# EAGLE design ATtiny85 Programmer (EAGLE 9.6.2)
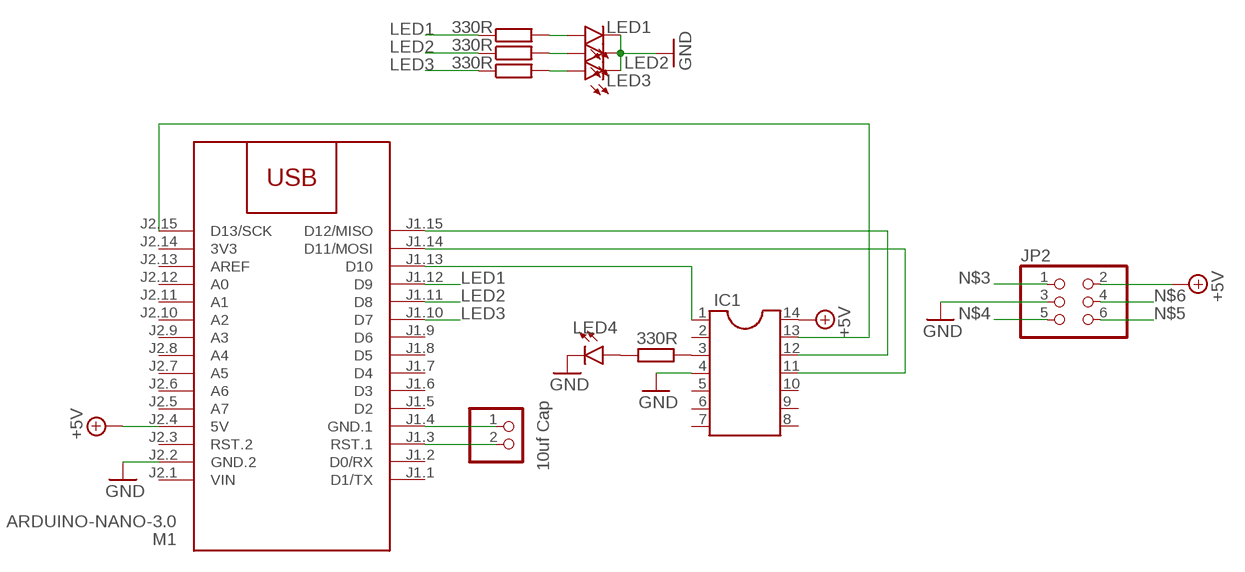
[diagram p0: schematic, sheet 1]

## Parts
IC1  DIL14  [DIL14]
JP1  10uf Cap  PINHD-1X2  [1X02]
JP2  PINHD-2X3  [2X03]
LED1  LED3MM  [LED3MM]
LED2  LED3MM  [LED3MM]
LED3  LED3MM  [LED3MM]
LED4  LED3MM  [LED3MM]
M1  ARDUINO-NANO-3.0  [ARDUINO-NANO-3.0]
R1  330R  R-EU_0207/10  [0207/10]
R2  330R  R-EU_0207/10  [0207/10]
R3  330R  R-EU_0207/10  [0207/10]
R4  330R  R-EU_0207/10  [0207/10]

## Nets
+5V: IC1.14 JP2.2 M1.J2.4(5V)
GND: IC1.4 JP2.3 LED1.K(C) LED2.K(C) LED3.K(C) LED4.K(C) M1.J2.2(GND.2)
LED1: M1.J1.12(D9) R4.1
LED2: M1.J1.11(D8) R1.1
LED3: M1.J1.10(D7) R2.1
N$1: JP1.2 M1.J1.3(RST.1)
N$2: JP1.1 M1.J1.4(GND.1)
N$3: IC1.1 JP2.1 M1.J1.13(D10)
N$4: IC1.11 JP2.5 M1.J1.14(D11/MOSI)
N$5: IC1.12 JP2.6 M1.J1.15(D12/MISO)
N$6: IC1.13 JP2.4 M1.J2.15(D13/SCK)
N$7: IC1.3 R3.2
N$8: LED1.A R4.2
N$9: LED2.A R1.2
N$10: LED3.A R2.2
N$13: LED4.A R3.1
Unconnected: IC1.2 IC1.5 IC1.6 IC1.7 IC1.8 IC1.9 IC1.10 M1.J1.1(D1/TX) M1.J1.2(D0/RX) M1.J1.5(D2) M1.J1.6(D3) M1.J1.7(D4) M1.J1.8(D5) M1.J1.9(D6) M1.J2.3(RST.2) M1.J2.5(A7) M1.J2.6(A6) M1.J2.7(A5) M1.J2.8(A4) M1.J2.9(A3) M1.J2.10(A2) M1.J2.11(A1) M1.J2.12(A0) M1.J2.13(AREF)

## Power pins joined to a net without a drawn wire
3V3: M1.J2.14(3V3)
VIN: M1.J2.1(VIN)

## Library data of the parts
IC1 = ic-package:DIL14: Dual In Line / Socket
JP1 = pinhead:PINHD-1X2: PIN HEADER
JP2 = pinhead:PINHD-2X3: PIN HEADER
LED1-LED4 = led:LED: LED OSRAM: - CHIPLED LG R971, LG N971, LY N971, LG Q971, LY Q971, LO R971, LY R971 LH N974, LH R974 LS Q976, LO Q976, LY Q976 LO Q996 - Hyper CHIPLED LW Q18S LB Q993, LB Q99A, LB R99A - SideLED LS A670, LO A670, LY A670, LG A670, LP A670 LB A673, LV A673, LT A673, LW A673 LH A674 LY A675 LS A676, LA A676, LO A676, LY A676, LW A676 LS A679, LY A679, LG A679 - Hyper Micro SIDELED® LS Y876, LA Y876, LO Y876, LY Y876 LT Y87S - SmartLED LW L88C, LW L88S LB L89C, LB L89S, LG L890 LS L89K, LO L89K, LY L89K LS L896, LA L896, LO L896, LY L896 - TOPLED LS T670, LO T670, LY T670, LG T670, LP T670 LSG T670, LSP T670, LSY T670, LOP T670, LYG T670 LG T671, LOG T671, LSG T671 LB T673, LV T673, LT T673, LW T673 LH T674 LS T676, LA T676, LO T676, LY T676, LB T676, LH T676, LSB T676, LW T676 LB T67C, LV T67C, LT T67C, LS T67K, LO T67K, LY T67K, LW E67C LS E67B, LA E67B, LO E67B, LY E67B, LB E67C, LV E67C, LT E67C LW T67C LS T679, LY T679, LG T679 LS T770, LO T770, LY T770, LG T770, LP T770 LB T773, LV T773, LT T773, LW T773 LH T774 LS E675, LA E675, LY E675, LS T675 LS T776, LA T776, LO T776, LY T776, LB T776 LHGB T686 LT T68C, LB T68C - Hyper Mini TOPLED® LB M676 - Mini TOPLED Santana® LG M470 LS M47K, LO M47K, LY M47K Source: http://www.osram.convergy.de LUXEON: - LUMILED® LXK2-PW12-R00, LXK2-PW12-S00, LXK2-PW14-U00, LXK2-PW14-V00 LXK2-PM12-R00, LXK2-PM12-S00, LXK2-PM14-U00 LXK2-PE12-Q00, LXK2-PE12-R00, LXK2-PE12-S00, LXK2-PE14-T00, LXK2-PE14-U00 LXK2-PB12-K00, LXK2-PB12-L00, LXK2-PB12-M00, LXK2-PB14-N00, LXK2-PB14-P00, LXK2-PB14-Q00 LXK2-PR12-L00, LXK2-PR12-M00, LXK2-PR14-Q00, LXK2-PR14-R00 LXK2-PD12-Q00, LXK2-PD12-R00, LXK2-PD12-S00 LXK2-PH12-R00, LXK2-PH12-S00 LXK2-PL12-P00, LXK2-PL12-Q00, LXK2-PL12-R00 Source: www.luxeon.com KINGBRIGHT: KA-3528ASYC Source: www.kingbright.com
M1 = diy-modules:ARDUINO-NANO-3.0: Arduino Nano 3.0 and compatible devices More details available here: https://www.arduino.cc/en/Main/ArduinoBoardNano Click here to find device on ebay.com <http://www.ebay.com/sch/arduino+nano>
R1-R4 = rcl:R-EU_: RESISTOR, European symbol; SPICEPREFIX: R

## Board
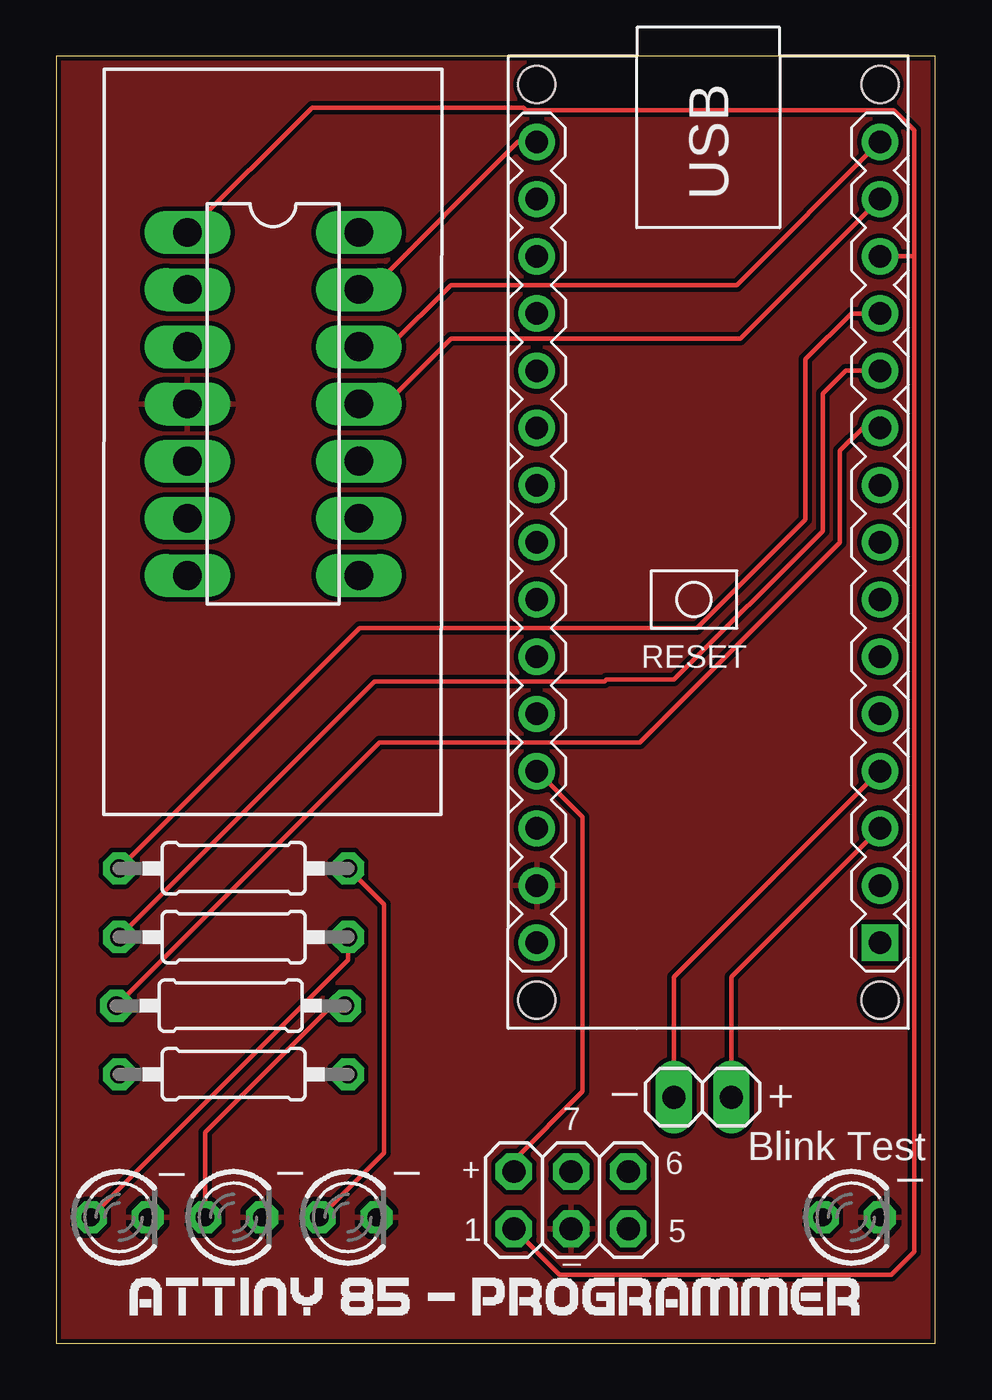
[diagram p1: board, top side]
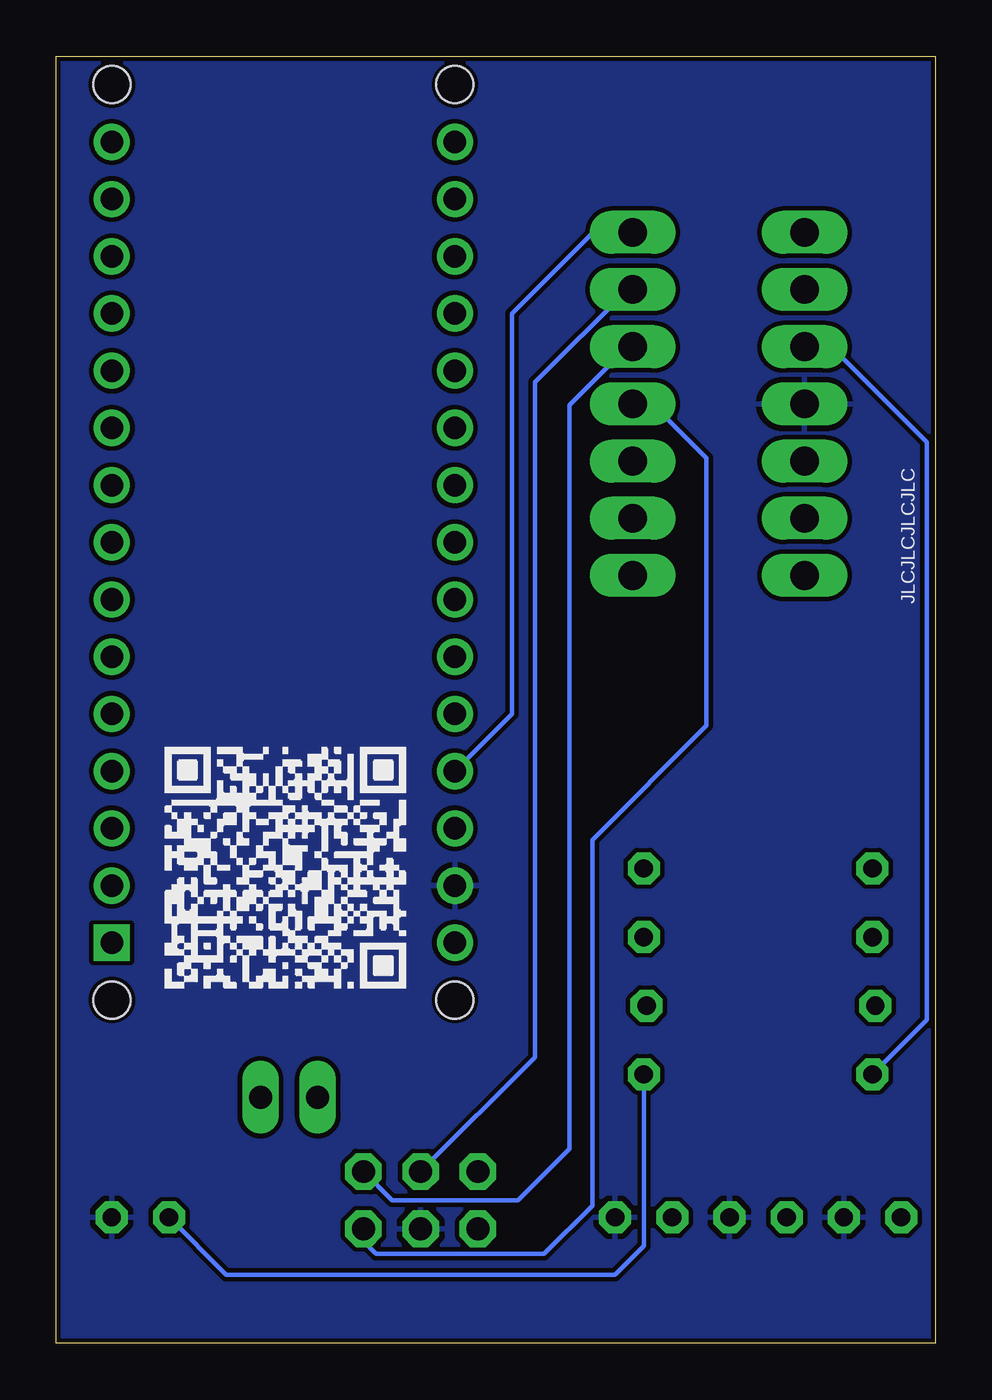
[diagram p2: board, bottom side, seen from below]

Size 39.04 x 57.14 mm. Coordinates in mm from the lower left corner, seen from the top.
Outline: 0,0 39.04,0 39.04,57.14 0,57.14 0,0
Copper layers (1*16): Top 0.035mm / dielectric 1.5mm / Bottom 0.035mm
Design rules "SparkFun": minimum track width 8mil, minimum drill 20mil, track to track 8mil, track to pad 8mil, pad to pad 8mil, via to via 8mil, smd to smd 8mil, copper to edge 8mil, drill to drill 8mil, minimum pad ring 12mil, minimum via ring 10mil, stop-mask expansion 4mil, vias tented up to drill 20mil, thermal gap 10mil

### Footprints (pad centres in the part's own frame; a part is rotated, then mirrored left to right if it is on the bottom)
DIL14 = drill 1.27 pad 1.524 long: 1 -7.62,-3.81; 2 -5.08,-3.81; 3 -2.54,-3.81; 4 0,-3.81; 5 2.54,-3.81; 6 5.08,-3.81; 7 7.62,-3.81; 8 7.62,3.81; 9 5.08,3.81; 10 2.54,3.81; 11 0,3.81; 12 -2.54,3.81; 13 -5.08,3.81; 14 -7.62,3.81
1X02 = drill 1.016 long: 1 -1.27,0; 2 1.27,0
2X03 = drill 1.016 octagon: 1 -2.54,-1.27; 2 -2.54,1.27; 3 0,-1.27; 4 0,1.27; 5 2.54,-1.27; 6 2.54,1.27
LED3MM = drill 0.813 octagon: A -1.27,0; K 1.27,0
ARDUINO-NANO-3.0 = drill 1 square: J1.1 17.78,7.62 | drill 1: J1.2 15.24,7.62; J1.3 12.7,7.62; J1.4 10.16,7.62; J1.5 7.62,7.62; J1.6 5.08,7.62; J1.7 2.54,7.62; J1.8 0,7.62; J1.9 -2.54,7.62; J1.10 -5.08,7.62; J1.11 -7.62,7.62; J1.12 -10.16,7.62; J1.13 -12.7,7.62; J1.14 -15.24,7.62; J1.15 -17.78,7.62; J2.1 17.78,-7.62; J2.2 15.24,-7.62; J2.3 12.7,-7.62; J2.4 10.16,-7.62; J2.5 7.62,-7.62; J2.6 5.08,-7.62; J2.7 2.54,-7.62; J2.8 0,-7.62; J2.9 -2.54,-7.62; J2.10 -5.08,-7.62; J2.11 -7.62,-7.62; J2.12 -10.16,-7.62; J2.13 -12.7,-7.62; J2.14 -15.24,-7.62; J2.15 -17.78,-7.62 | hole 1.651: -20.32,7.62; -20.32,-7.62; 20.32,-7.62; 20.32,7.62
0207/10 = drill 0.813 octagon: 1 -5.08,0; 2 5.08,0

### Placement (x,y rotation side)
IC1  9.63,41.71 270 top
JP1  28.7,10.92 0 top
JP2  22.86,6.35 0 top
LED1  12.95,5.59 0 top
LED2  2.79,5.59 0 top
LED3  7.87,5.59 0 top
LED4  35.31,5.59 0 top
M1  28.96,35.56 270 top
R1  7.87,18.03 0 top
R2  7.75,14.99 0 top
R3  7.87,11.94 180 top
R4  7.87,21.08 0 top

### Tracks (layer width: path | path; a pad name or v marks a point on that pad's centre or on a via)
+5V
  Top 0.203: JP2.2 20.32,8.13 23.37,11.18 23.37,23.37 M1.J2.4
  Bottom 0.203: M1.J2.4 18.8,27.94 18.8,45.72 15.19,49.33 IC1.14
GND
  pour Top: 0,57.15 39.12,57.15 39.12,0 0,0
  pour Bottom: 0,57.15 39.12,57.15 39.12,0 0,0
LED1
  Top 0.203: R4.1 13.46,31.75 28.45,31.75 33.27,36.58 33.27,43.69 35.31,45.72 M1.J1.12
LED2
  Top 0.203: R1.1 14.13,29.37 24.34,29.37 24.43,29.46 27.43,29.46 34.04,36.07 34.04,42.16 35.05,43.18 M1.J1.11
LED3
  Top 0.203: R2.1 14.35,26.67 25.91,26.67 34.8,35.56 34.8,39.62 35.81,40.64 M1.J1.10
N$1
  Top 0.203: JP1.2 29.97,16.26 M1.J1.3
N$2
  Top 0.203: JP1.1 27.43,16.26 M1.J1.4
N$3
  Top 0.203: JP2.1 22.35,3.05 37.08,3.05 38.1,4.06 38.1,48.26 | 38.1,48.26 38.1,53.85 37.2,54.75 20.87,54.75 20.75,54.86 11.35,54.86 IC1.1 | M1.J1.13 38.1,48.26
N$4
  Top 0.203: M1.J1.14 30.39,44.61 17.53,44.61 14.62,41.71 IC1.11
  Bottom 0.203: JP2.5 25.4,4.52 24.85,3.96 17.37,3.96 15.24,6.1 15.24,22.35 10.16,27.43 10.16,39.31 12.56,41.71 IC1.11
N$5
  Top 0.203: M1.J1.15 30.23,46.99 17.53,46.99 14.78,44.25 IC1.12
  Bottom 0.203: JP2.6 24.13,6.35 18.54,6.35 16.26,8.64 16.26,41.66 13.66,44.25 IC1.12
N$6
  Top 0.203: M1.J2.15 20.51,53.34 13.96,46.79 IC1.13
  Bottom 0.203: JP2.4 17.78,12.7 17.78,42.67 13.66,46.79 IC1.13
N$7
  Bottom 0.203: IC1.3 4.62,44.25 0.38,40.01 0.38,14.35 R3.2
N$8
  Top 0.203: R4.2 14.55,19.48 14.55,8.46 LED1.A
N$9
  Top 0.203: LED2.A 12.95,17.02 R1.2
N$10
  Top 0.203: LED3.A 6.6,9.37 12.22,14.99 R2.2
N$13
  Bottom 0.203: R3.1 12.95,4.32 14.22,3.05 31.5,3.05 LED4.A

### Text on the board
tPlace: _ | + | 7 | Blink Test | _ | _ | _ | + | 6 | _ | 1 | _ | 5
bPlace: JLCJLCJLCJLC